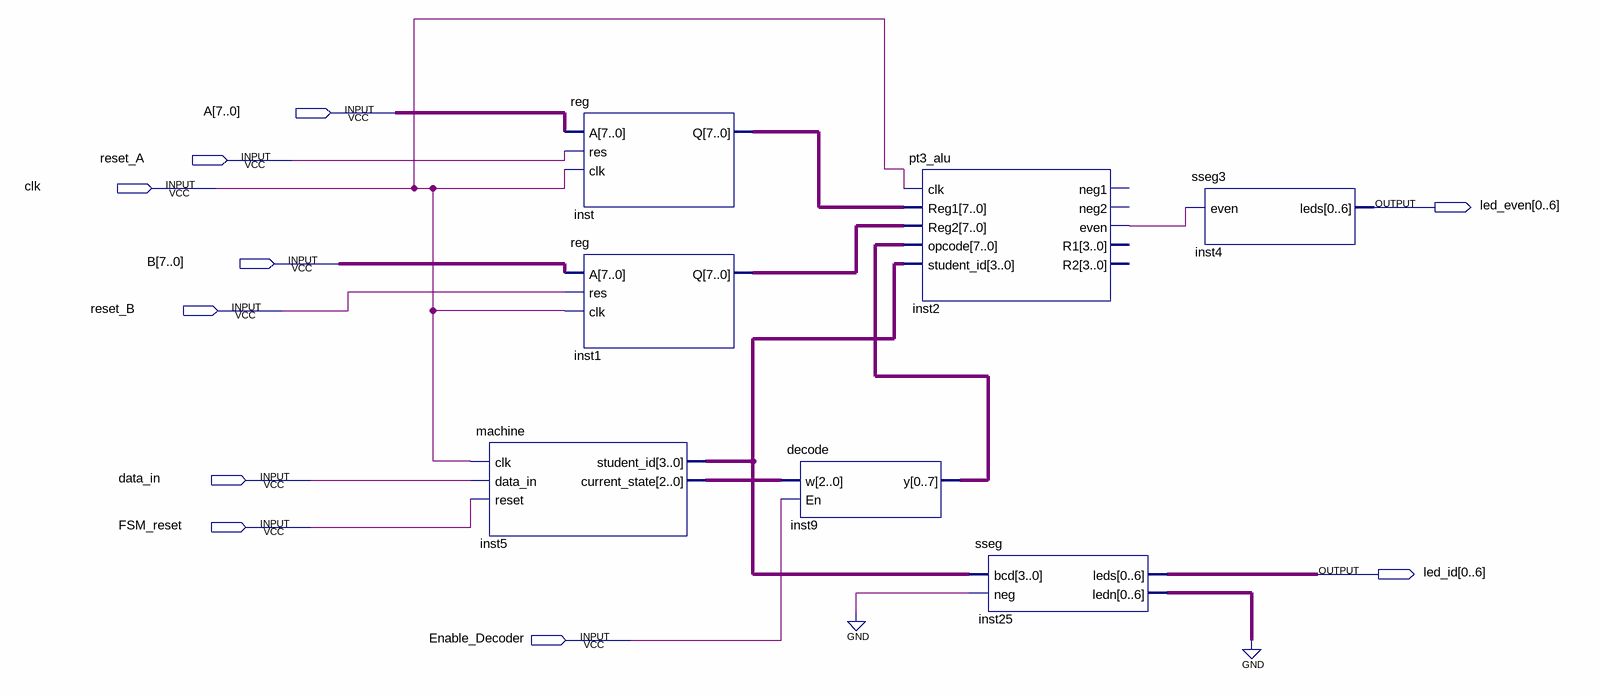
[diagram p0: schematic sheet]
// Quartus schematic FULL3.bdf as structural Verilog: 7 symbols, 10 pins
module FULL3 (
  input  [7:0] A,
  input  reset_A,
  input  clk,
  input  [7:0] B,
  input  reset_B,
  input  data_in,
  input  FSM_reset,
  input  Enable_Decoder,
  output [0:6] led_even,
  output [0:6] led_id
);

  wire inst2_even;
  wire [2:0] inst5_current_state;
  wire [3:0] inst5_student_id;
  wire [6:0] inst25_ledn;
  wire [7:0] inst1_q, inst9_y, inst_q;

  machine inst5 (
    .clk(clk), .data_in(data_in), .reset(FSM_reset), .student_id(inst5_student_id),
    .current_state(inst5_current_state));
  \reg  inst (.A(A), .res(reset_A), .clk(clk), .Q(inst_q));
  \reg  inst1 (.A(B), .res(reset_B), .clk(clk), .Q(inst1_q));
  decode inst9 (.w(inst5_current_state), .En(Enable_Decoder), .y(inst9_y));
  pt3_alu inst2 (
    .clk(clk), .Reg1(inst_q), .Reg2(inst1_q), .opcode(inst9_y), .student_id(inst5_student_id),
    .even(inst2_even));  // open: neg1, neg2, R1, R2
  sseg inst25 (.bcd(inst5_student_id), .neg(1'b0), .leds(led_id), .ledn(inst25_ledn));
  sseg3 inst4 (.even(inst2_even), .leds(led_even));
  // also tied to GND on the sheet: {inst25_ledn[0], inst25_ledn[1], inst25_ledn[2], inst25_ledn[3], inst25_ledn[4], inst25_ledn[5], inst25_ledn[6]}
endmodule
